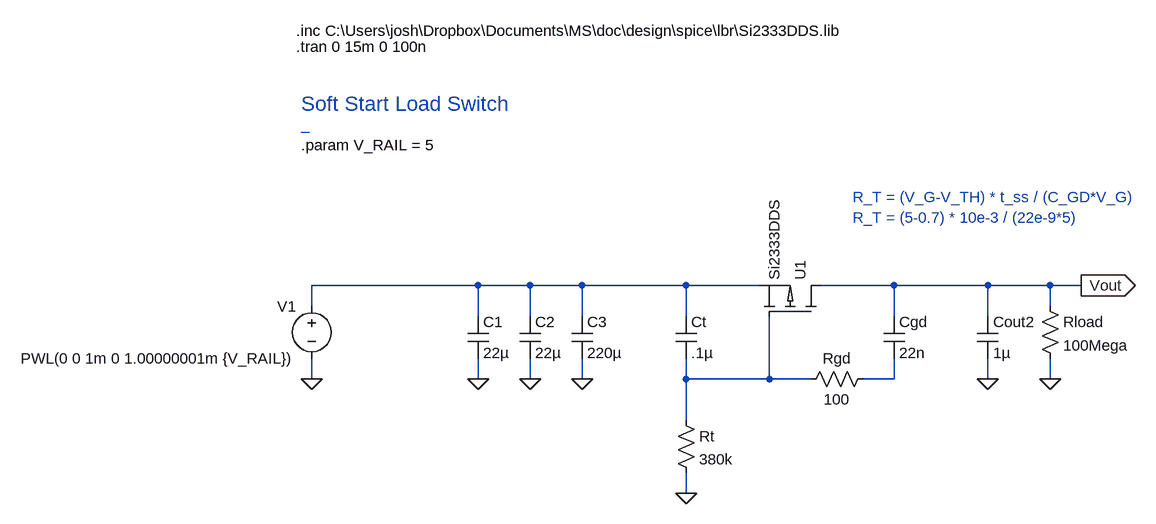
[diagram p0: schematic soft_start_5V_pmos.asc]
soft_start_5V_pmos.asc, the LTspice schematic file:
Version 4
SHEET 1 1920 680
WIRE -480 -80 -736 -80
WIRE -400 -80 -480 -80
WIRE -320 -80 -400 -80
WIRE -160 -80 -320 -80
WIRE -48 -80 -160 -80
WIRE 160 -80 48 -80
WIRE 304 -80 160 -80
WIRE 400 -80 304 -80
WIRE 448 -80 400 -80
WIRE -736 -48 -736 -80
WIRE 400 -48 400 -80
WIRE -480 -32 -480 -80
WIRE -400 -32 -400 -80
WIRE -320 -32 -320 -80
WIRE -160 -32 -160 -80
WIRE 160 -32 160 -80
WIRE 304 -32 304 -80
WIRE -736 64 -736 32
WIRE -480 64 -480 32
WIRE -400 64 -400 32
WIRE -320 64 -320 32
WIRE -160 64 -160 32
WIRE -32 64 -32 -32
WIRE -32 64 -160 64
WIRE 32 64 -32 64
WIRE 160 64 160 32
WIRE 160 64 112 64
WIRE 304 64 304 32
WIRE 400 64 400 32
WIRE -160 128 -160 64
WIRE -160 240 -160 208
FLAG 448 -80 Vout
IOPIN 448 -80 Out
FLAG 400 64 0
FLAG -160 240 0
FLAG -480 64 0
FLAG -400 64 0
FLAG -320 64 0
FLAG 304 64 0
FLAG -736 64 0
SYMBOL res 384 -64 R0
SYMATTR InstName Rload
SYMATTR Value 100Mega
SYMBOL res -176 112 R0
SYMATTR InstName Rt
SYMATTR Value 380k
SYMBOL cap -176 -32 R0
SYMATTR InstName Ct
SYMATTR Value .1µ
SYMBOL Si2333DDS 48 -32 M270
SYMATTR InstName U1
SYMBOL res 128 48 R90
WINDOW 0 0 56 VBottom 2
WINDOW 3 32 56 VTop 2
SYMATTR InstName Rgd
SYMATTR Value 100
SYMBOL cap 144 -32 R0
SYMATTR InstName Cgd
SYMATTR Value 22n
SYMBOL cap -496 -32 R0
SYMATTR InstName C1
SYMATTR Value 22µ
SYMBOL cap -416 -32 R0
SYMATTR InstName C2
SYMATTR Value 22µ
SYMBOL cap -336 -32 R0
SYMATTR InstName C3
SYMATTR Value 220µ
SYMBOL cap 288 -32 R0
SYMATTR InstName Cout2
SYMATTR Value 1µ
SYMBOL voltage -736 -64 M0
WINDOW 123 0 0 Left 2
WINDOW 39 0 0 Left 2
SYMATTR InstName V1
SYMATTR Value PWL(0 0 1m 0 1.00000001m {V_RAIL})
TEXT -760 -472 Left 2 !.inc C:\\Users\\josh\\Dropbox\\Documents\\MS\\doc\\design\\spice\\lbr\\Si2333DDS.lib
TEXT -760 -448 Left 2 !.tran 0 15m 0 100n
TEXT -752 -360 Left 3 ;Soft Start Load Switch
TEXT -752 -296 Left 2 !.param V_RAIL = 5
TEXT -752 -328 Left 2 ;_
TEXT 96 -216 Left 2 ;R_T = (V_G-V_TH) * t_ss / (C_GD*V_G)\nR_T = (5-0.7) * 10e-3 / (22e-9*5)

The netlist it stands for:
* soft_start_5V_pmos.asc
Rload Vout 0 100Mega
Rt N002 0 380k
Ct N001 N002 .1µ
XU1 Vout N002 N001 Si2333DDS  ; pins D G S
Rgd N003 N002 100
Cgd Vout N003 22n
C1 N001 0 22µ
C2 N001 0 22µ
C3 N001 0 220µ
Cout2 Vout 0 1µ
V1 N001 0 PWL(0 0 1m 0 1.00000001m {V_RAIL})
.inc C:\Users\josh\Dropbox\Documents\MS\doc\design\spice\lbr\Si2333DDS.lib
.tran 0 15m 0 100n
* Soft Start Load Switch
.param V_RAIL = 5
* _
* R_T = (V_G-V_TH) * t_ss / (C_GD*V_G)
* R_T = (5-0.7) * 10e-3 / (22e-9*5)
.backanno
.end